# EAGLE design 1 (EAGLE 6.5.0)
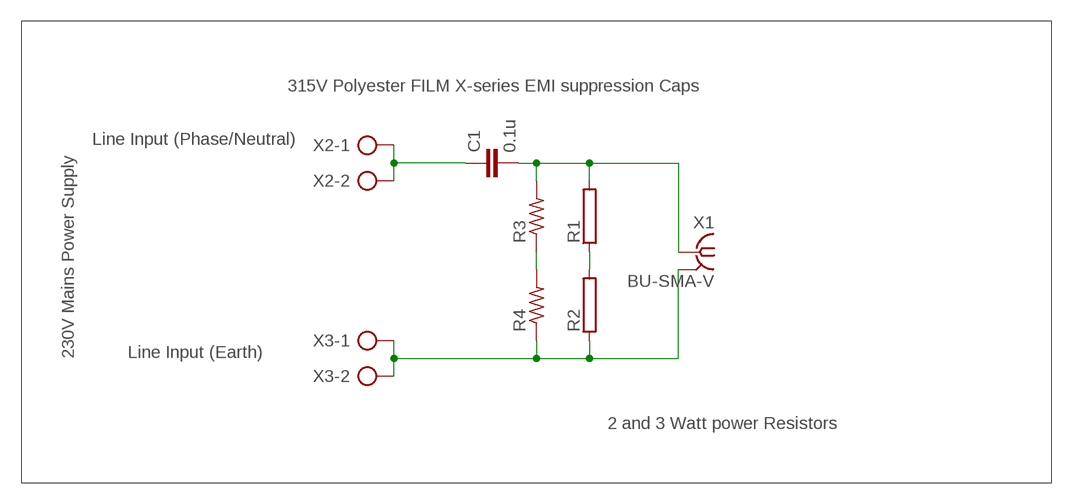
[diagram p0: schematic, sheet 1]

## Parts
C1  0.1u  C15/5  [C15B5]
R1  RAC01  [AC01]
R2  RAC01  [AC01]
R3  R-US_M1206  [M1206]
R4  R-US_M1206  [M1206]
X1  BU-SMA-V  [BU-SMA-V]
X2  AK500/2  [AK500/2]
X3  AK500/2  [AK500/2]

## Nets
N$1: R3.1 R4.2
N$3: R1.1 R2.2
N$6: C1.2 R1.2 R3.2 X1.1
N$8: C1.1 X2.1 X2.2
N$9: R2.1 R4.1 X1.2(GND) X3.1 X3.2

## Notes on the sheet
- 315V Polyester FILM X-series EMI suppression Caps
- Line Input (Phase/Neutral)
- 230V Mains Power Supply | Line Input (Earth)
- 2 and 3 Watt power Resistors

## Power pins joined to a net without a drawn wire
GND: X1.3(GND) X1.4(GND) X1.5(GND)

## Library data of the parts
C1 = capacitor-wima:C: CAPACITOR naming: grid - package width
R1 R2 = resistor-power:R: Power Resitor; OC_FARNELL: unknown; OC_NEWARK: unknown
R3 R4 = rcl:R-US_: RESISTOR, American symbol
X1 = con-coax:BU-SMA-V: FEMALE SMA CONNECTOR Radiall distributor RS 112-3794; OC_FARNELL: unknown; OC_NEWARK: unknown
X2 X3 = con-ptr500:AK500/2: CONNECTOR; OC_FARNELL: unknown; OC_NEWARK: unknown

## Board
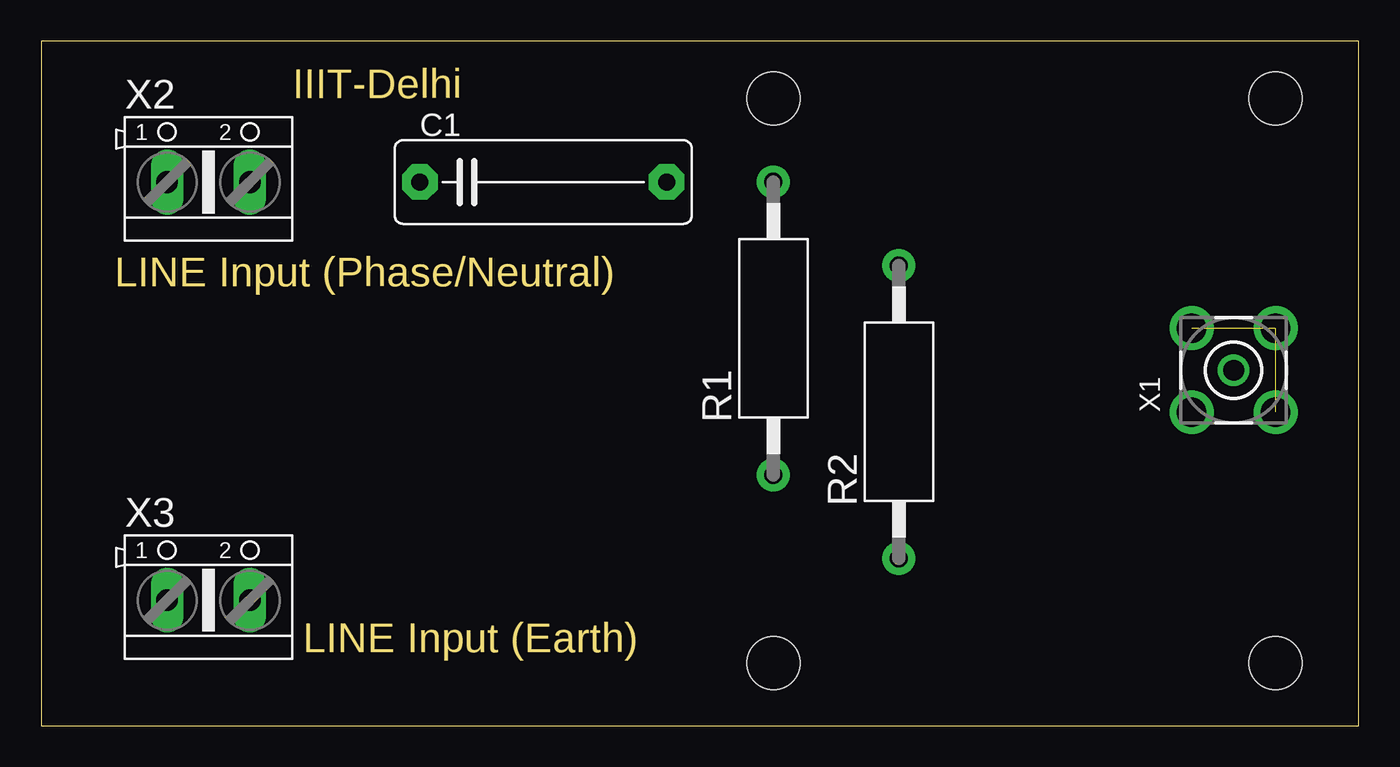
[diagram p1: board, top side]
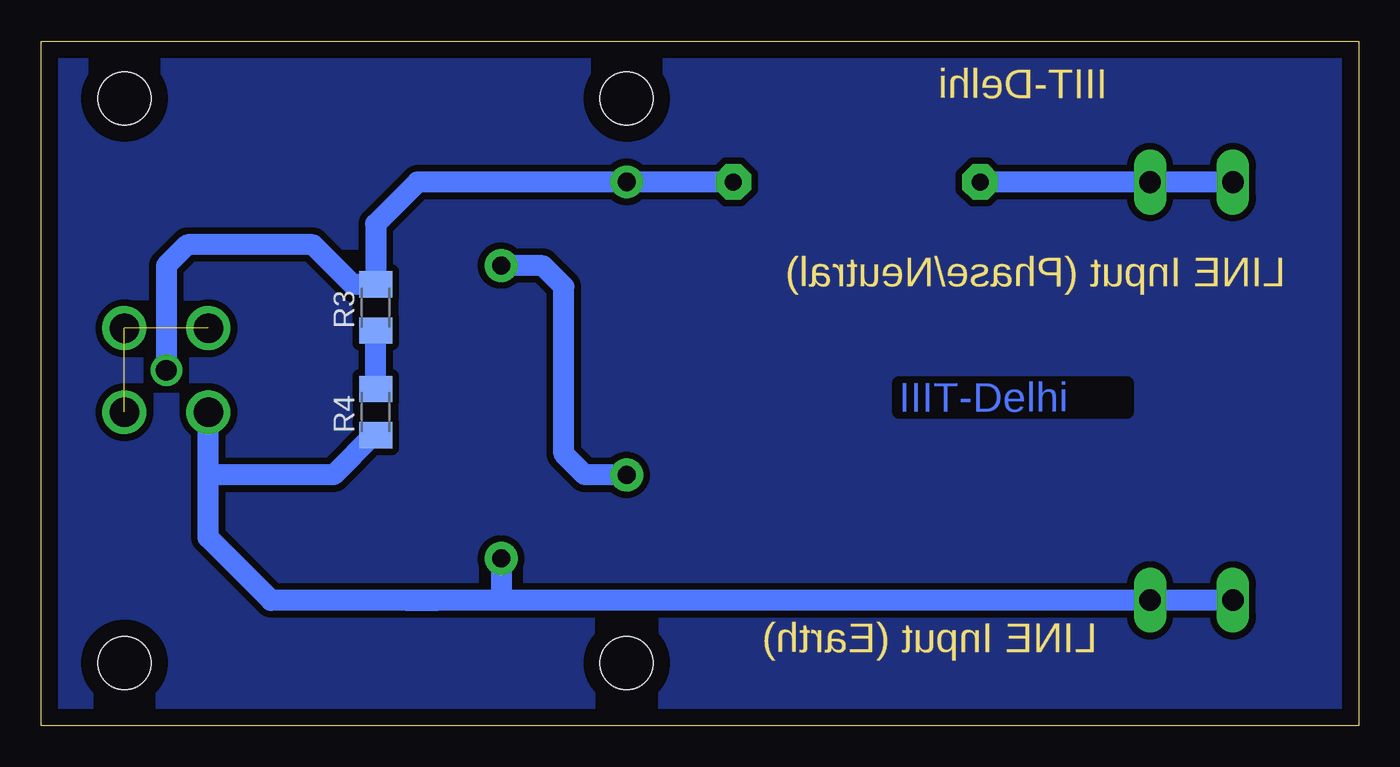
[diagram p2: board, bottom side, seen from below]

Size 79.99 x 41.58 mm. Coordinates in mm from the lower left corner, seen from the top.
Outline: 0,0 79.99,0 79.99,41.58 0,41.58 0,0
Copper layers (1*16): Top 0.035mm / dielectric 1.5mm / Bottom 0.035mm
Design rules "default": minimum track width 10mil, minimum drill 24mil, track to track 8mil, track to pad 8mil, pad to pad 8mil, via to via 8mil, smd to smd 8mil, copper to edge 40mil, drill to drill 8mil, minimum pad ring 10mil, minimum via ring 8mil, stop-mask expansion 4mil, vias tented up to drill 0mil, thermal gap 10mil
Holes 3.2 mm at 74.93,38.1 74.93,3.81 44.45,38.1 44.45,3.81

### Footprints (pad centres in the part's own frame; a part is rotated, then mirrored left to right if it is on the bottom)
C15B5 = drill 1.016 pad 2.159 octagon: 1 -7.493,0; 2 7.493,0
AC01 = drill 1.1 pad 2: 1 -8.9,0; 2 8.9,0
M1206 = smd 1.6 x 2: 1 -1.4,0; 2 1.4,0
BU-SMA-V = drill 1.27: 1 0,0 | drill 1.778: 2 -2.55,2.55; 3 2.55,2.55; 4 2.55,-2.55; 5 -2.55,-2.55
AK500/2 = drill 1.321 long: 1 -2.515,0; 2 2.515,0

### Placement (x,y rotation side)
C1  30.48,33.02 0 top
R1  44.45,24.13 90 top
R2  52.07,19.05 90 top
R3  59.69,25.4 90 bottom
R4  59.69,19.05 90 bottom
X1  72.39,21.59 90 top
X2  10.16,33.02 0 top
X3  10.16,7.62 0 top

### Tracks (layer width: path | path; a pad name or v marks a point on that pad's centre or on a via)
GND  (2 unrouted)
N$1
  Bottom 1.27: R4.2 R3.1
N$2
  pour Bottom (isolate 0.406): 1.27,40.64 78.74,40.64 78.74,2.54 78.74,1.27 78.74,0.64 0.64,0.64 0.64,12.7 0.64,40.64
N$3
  Bottom 1.27: R1.1 46.98,15.23 48.26,16.51 48.26,26.67 49.53,27.94 R2.2
N$6
  Bottom 1.27: C1.2 R1.2 57.14,33.03 59.69,30.48 R3.2 61.09,26.8 63.5,29.21 71.12,29.21 72.39,27.94 X1.1
N$8
  Bottom 1.27: X2.1 X2.2 C1.1
N$9
  Bottom 1.27: X3.1 X3.2 | X3.2 12.7,7.62 12.7,6.35 | 57.77,7.61 55.88,7.62 | X3.2 52.07,7.62 | 52.07,7.62 55.88,7.62 | 69.85,15.24 69.85,11.43 66.03,7.61 66.02,7.62 55.88,7.62 | 69.85,15.24 X1.2 | R2.1 52.07,7.62 | R4.1 59.82,17.65 62.23,15.24 69.85,15.24

### Text on the board
Bottom: IIIT-Delhi
Dimension: IIIT-Delhi | LINE Input (Phase/Neutral) | LINE Input (Earth)